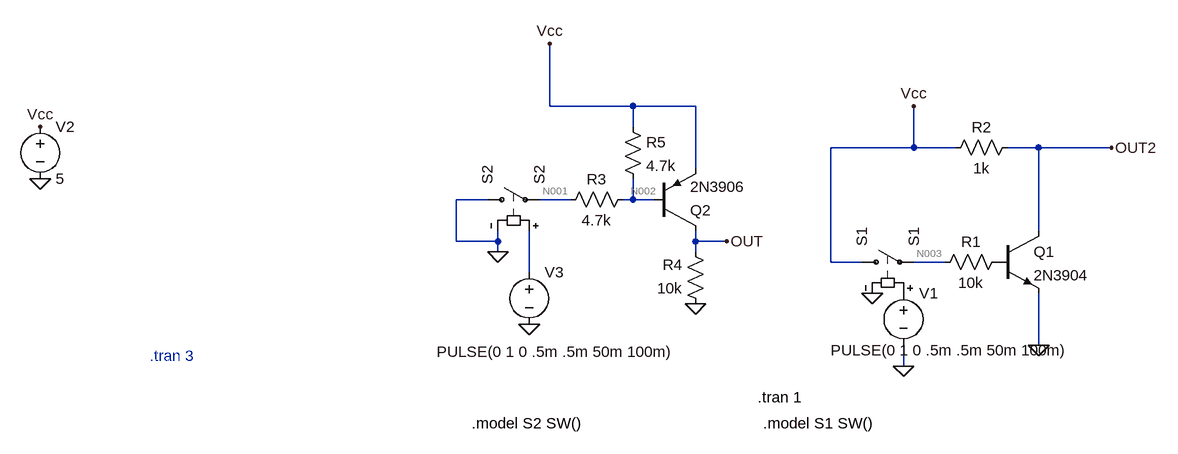
[diagram p0: schematic pnp_inverter.asc]
pnp_inverter.asc, the LTspice schematic file:
Version 4.1
SHEET 1 1572 680
WIRE 544 -64 544 -160
WIRE 672 -64 544 -64
WIRE 768 -64 672 -64
WIRE 672 -32 672 -64
WIRE 1104 0 1104 -64
WIRE 1104 0 976 0
WIRE 1168 0 1104 0
WIRE 1296 0 1248 0
WIRE 1408 0 1296 0
WIRE 768 32 768 -64
WIRE 448 80 400 80
WIRE 576 80 528 80
WIRE 672 80 672 48
WIRE 672 80 656 80
WIRE 704 80 672 80
WIRE 1296 128 1296 0
WIRE 400 144 400 80
WIRE 464 144 464 128
WIRE 464 144 400 144
WIRE 768 144 768 128
WIRE 816 144 768 144
WIRE 464 160 464 144
WIRE 768 160 768 144
WIRE 976 176 976 0
WIRE 1024 176 976 176
WIRE 1152 176 1104 176
WIRE 512 192 512 128
WIRE 1296 304 1296 224
WIRE 1088 336 1088 304
FLAG -240 48 0
FLAG -240 -32 Vcc
FLAG 544 -160 Vcc
FLAG 816 144 OUT
FLAG 512 272 0
FLAG 768 240 0
FLAG 1296 304 0
FLAG 1104 -64 Vcc
FLAG 1040 224 0
FLAG 1088 336 0
FLAG 464 160 0
FLAG 1408 0 OUT2
SYMBOL voltage -240 -48 R0
WINDOW 123 0 0 Left 0
WINDOW 39 0 0 Left 0
SYMATTR InstName V2
SYMATTR Value 5
SYMBOL voltage 512 176 R0
WINDOW 3 -142 138 Left 2
WINDOW 123 0 0 Left 0
WINDOW 39 0 0 Left 0
SYMATTR Value PULSE(0 1 0 .5m .5m 50m 100m)
SYMATTR InstName V3
SYMBOL pnp 704 128 M180
SYMATTR InstName Q2
SYMATTR Value 2N3906
SYMBOL res 672 64 R90
WINDOW 0 0 56 VBottom 2
WINDOW 3 32 56 VTop 2
SYMATTR InstName R3
SYMATTR Value 4.7k
SYMBOL res 784 256 R180
WINDOW 0 36 76 Left 2
WINDOW 3 36 40 Left 2
SYMATTR InstName R4
SYMATTR Value 10k
SYMBOL res 656 -48 R0
SYMATTR InstName R5
SYMATTR Value 4.7k
SYMBOL npn 1232 128 R0
SYMATTR InstName Q1
SYMATTR Value 2N3904
SYMBOL res 1248 160 R90
WINDOW 0 0 56 VBottom 2
WINDOW 3 32 56 VTop 2
SYMATTR InstName R1
SYMATTR Value 10k
SYMBOL res 1264 -16 R90
WINDOW 0 0 56 VBottom 2
WINDOW 3 32 56 VTop 2
SYMATTR InstName R2
SYMATTR Value 1k
SYMBOL sw 1008 176 R270
SYMATTR InstName S1
SYMATTR Value S1
SYMBOL voltage 1088 208 R0
WINDOW 3 -112 104 Left 2
WINDOW 123 0 0 Left 0
WINDOW 39 0 0 Left 0
SYMATTR Value PULSE(0 1 0 .5m .5m 50m 100m)
SYMATTR InstName V1
SYMBOL sw 432 80 R270
SYMATTR InstName S2
SYMATTR Value S2
TEXT -72 320 Left 2 ;.tran 3
TEXT 872 424 Left 2 !.model S1 SW()
TEXT 864 384 Left 2 !.tran 1
TEXT 424 424 Left 2 !.model S2 SW()

The netlist it stands for:
* pnp_inverter.asc
V2 Vcc 0 5
V3 N004 0 PULSE(0 1 0 .5m .5m 50m 100m)
Q2 OUT N002 Vcc 0 2N3906
R3 N002 N001 4.7k
R4 0 OUT 10k
R5 Vcc N002 4.7k
Q1 OUT2 P001 0 0 2N3904
R1 P001 N003 10k
R2 OUT2 Vcc 1k
S1 Vcc N003 P002 0 S1
V1 P002 0 PULSE(0 1 0 .5m .5m 50m 100m)
S2 0 N001 N004 0 S2
.model NPN NPN
.model PNP PNP
.lib standard.bjt
* .tran 3
.model S1 SW()
.tran 1
.model S2 SW()
.backanno
.end

* Results of the author's LTspice run, read from the files saved beside the schematic
* Operating Point, zero values left out:
*   V(n002) = 5 V
*   V(n001) = 5 V
*   V(p001) = 334.3 mV
*   V(vcc) = 5 V
*   V(out) = 50.13 nV
*   V(out2) = 5 V
*   V(n003) = 334.3 mV
*   Ic(Q2) = -5.013 pA
*   Ib(Q2) = 5.002 pA
*   I(R4) = -5.013 pA
*   I(R5) = 15 pA
*   I(V2) = -4.32 nA
*   I(R1) = -9.331 pA
*   I(R3) = 10 pA
*   Ic(Q1) = 4.296 nA
*   Ib(Q1) = 9.331 pA
*   Ie(Q1) = -4.305 nA
*   I(R2) = -4.296 nA
*   I(S1) = -9.331 pA
*   I(S2) = 10 pA
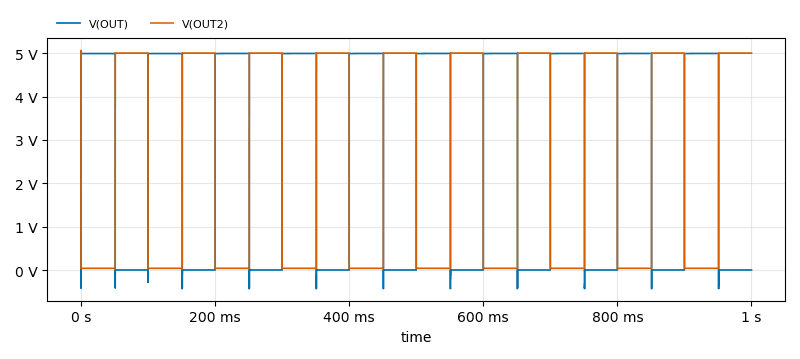
[diagram p1: Transient Analysis of pnp_inverter.asc, plotted from the saved traces]
* Transient Analysis, 1 run:
*   V(OUT): min -433.2 mV, max 4.995 V, average 2.545 V, rms 3.564 V, last 0 V
*   V(OUT2): min 39.19 mV, max 5.064 V, average 2.47 V, rms 3.5 V, last 5.001 V